# EasyEDA schematic SCH_RFID-esp32-design_2024-09-27.json
TITLE: Sheet_1; REV: 1.0; Date: 2020-11-05; Sheet: 1/1; Drawn By: jwkelly49; Company: Your Company
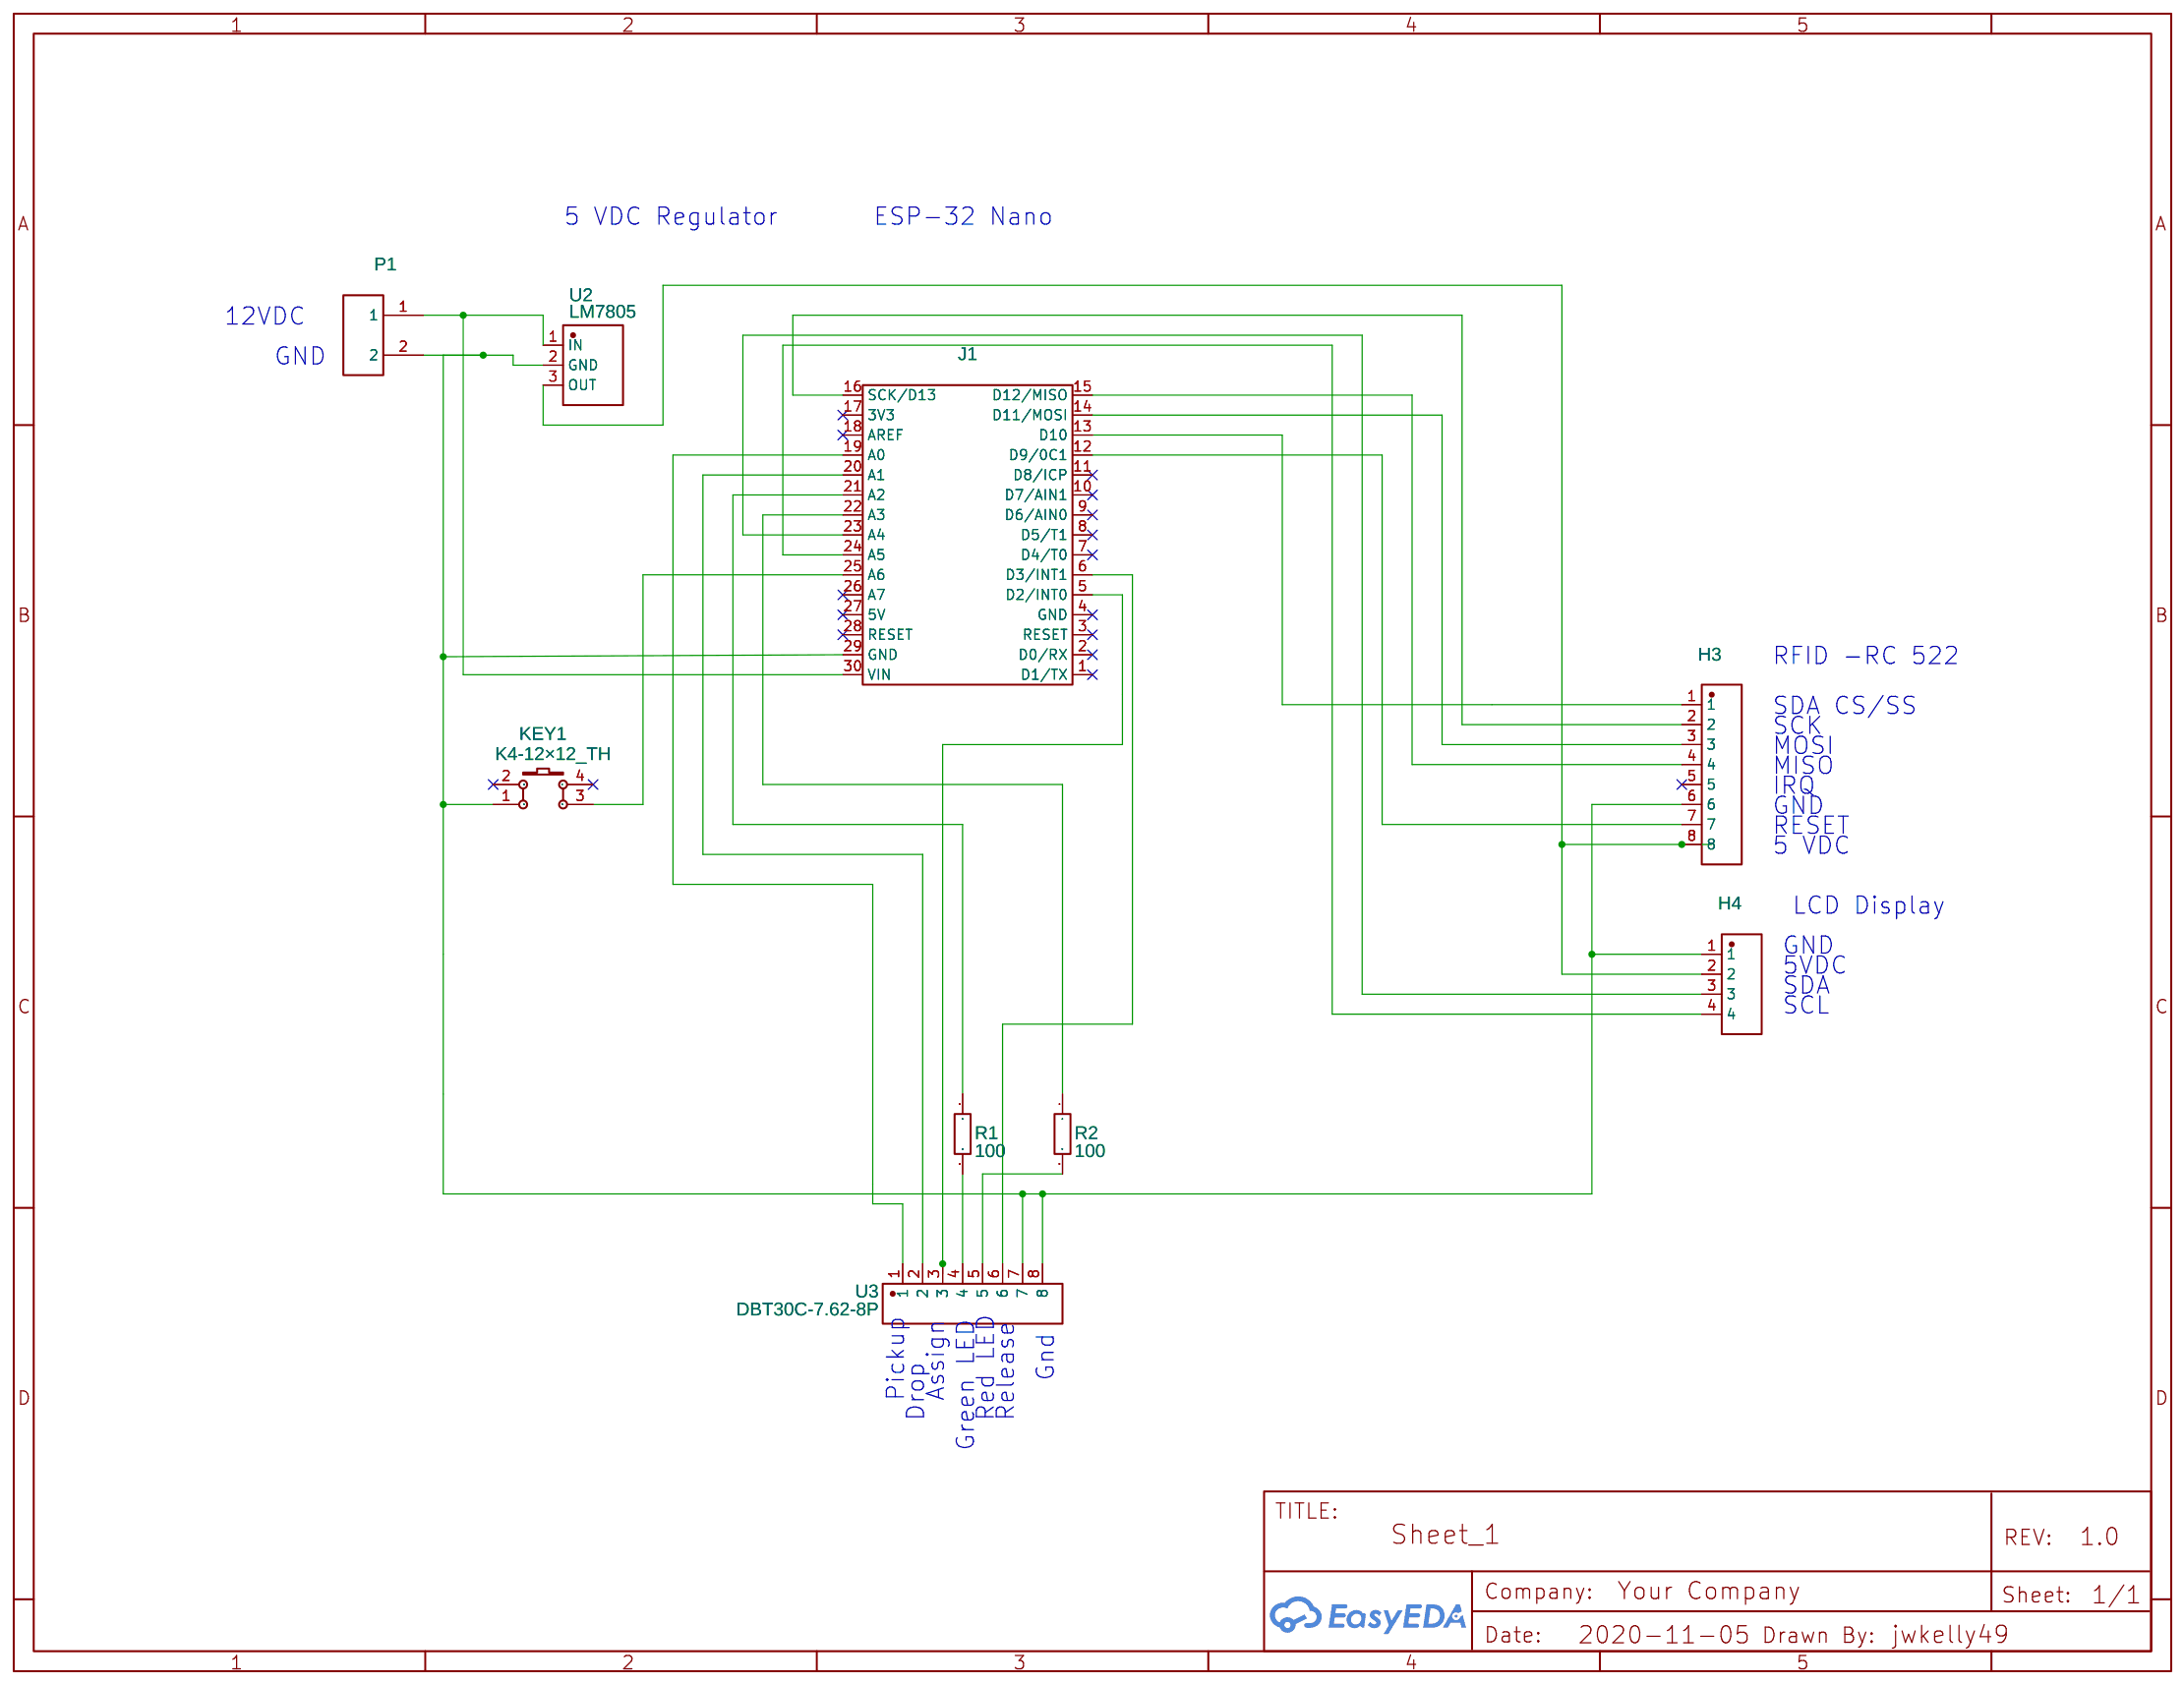
[diagram p0: schematic sheet]

## Parts
H3  MTB125-1108R1  [HDR-TH_8P-P2.54-H-W10.0]
H4  PZ254R-11-04P  [HDR-TH_4P-P2.54-H-M-W10.4]
J1  Arduino_Nano_Header  [DIP-30_L43.18-W15.24-ARDUINONANO]
KEY1  K4-12×12_TH  [KEY-TH_4P-L12.0-W12.0-P5.00-LS12.5]
P1  WJ45C-B-2P  [CONN-TH_2P-P9.50_WJ45C-B-2P]
R1  100  [RES-TH_BD2.3-L6.5-P10.50-D0.5]
R2  100  [RES-TH_BD2.3-L6.5-P10.50-D0.5]
U2  LM7805  [TO-220-3_L10.0-W4.5-P2.54-L]
U3  DBT30C-7.62-8P  [CONN-TH_8P-P7.62_DBT30C-7.62-8P]

## Library data of the parts
H3 = MTB125-1108R1: Supplier: LCSC; Supplier Part: C376126; Manufacturer: MINTRON; Contributor: LCSC
H4 = PZ254R-11-04P: Supplier: LCSC; Supplier Part: C492412; Manufacturer: XFCN; Contributor: LCSC
KEY1 = K4-12×12_TH: Supplier Part: C128053; Supplier: LCSC; Manufacturer: 韩国韩荣; Manufacturer Part: K2-1103DP-M4SW-04; Contributor: LCEDA_Lib
P1 = WJ45C-B-2P: Supplier: LCSC; Manufacturer: ReliaPro; image: //image.lceda.cn/szlcsc/C8397.jpg; Supplier Part: C8397
R1 R2 = CF1/4W-100Ω±5% T52: Supplier: LCSC; Supplier Part: C69872; Manufacturer: UniOhm; Manufacturer Part: CFR02SJ0101A10; Contributor: LCSC
U2 = LM7805: Supplier: LCSC; Supplier Part: C845394; Manufacturer: TF; Contributor: LCSC
U3 = DBT30C-7.62-8P: Contributor: LCSC; Supplier: LCSC; Supplier Part: C395944; Manufacturer: DORABO(地博电气); Manufacturer Part: DBT30C-7.62-8P-BK-P; JLCPCB Part Class: Extended Part

## Nets
Net-(H3-1): H3.1 J1.13(D10)
Net-(H3-2): H3.2 J1.16(SCK/D13)
Net-(H3-3): H3.3 J1.14(D11/MOSI)
Net-(H3-4): H3.4 J1.15(D12/MISO)
Net-(H3-6): H3.6 H4.1 J1.29(GND) KEY1.1 P1.2 U2.2(GND) U3.7 U3.8
Net-(H3-7): H3.7 J1.12(D9/0C1)
Net-(H3-8): H3.8 H4.2 U2.3(OUT)
Net-(H4-3): H4.3 J1.23(A4)
Net-(H4-4): H4.4 J1.24(A5)
Net-(J1-5): J1.5(D2/INT0) U3.3
Net-(J1-6): J1.6(D3/INT1) U3.6
Net-(J1-19): J1.19(A0) U3.1
Net-(J1-20): J1.20(A1) U3.2
Net-(J1-21): J1.21(A2) R1.1
Net-(J1-22): J1.22(A3) R2.1
Net-(J1-25): J1.25(A6) KEY1.3
Net-(J1-30): J1.30(VIN) P1.1 U2.1(IN)
Net-(R1-2): R1.2 U3.4
Net-(R2-2): R2.2 U3.5

Not connected (* = marked no-connect by the designer): H3 5*; J1 1(D1/TX)* 2(D0/RX)* 3(RESET)* 4(GND)* 7(D4/T0)* 8(D5/T1)* 9(D6/AIN0)* 10(D7/AIN1)* 11(D8/ICP)* 17(3V3)* 18(AREF)* 26(A7)* 27(5V)* 28(RESET)*; KEY1 2* 4*

## Notes on the sheet
- 5 VDC Regulator
- ESP-32 Nano
- 12VDC
- GND
- RFID -RC 522
- SDA CS/SS
- SCK
- MISO
- MOSI
- IRQ
- GND
- RESET
- 5 VDC
- LCD Display
- GND
- 5VDC
- SDA
- SCL
- Gnd
- Pickup
- Assign
- Drop
- Red LED
- Release
- Green LED
